# EAGLE design shinobi_5v_3V3_dcdc (EAGLE 8.2.2)
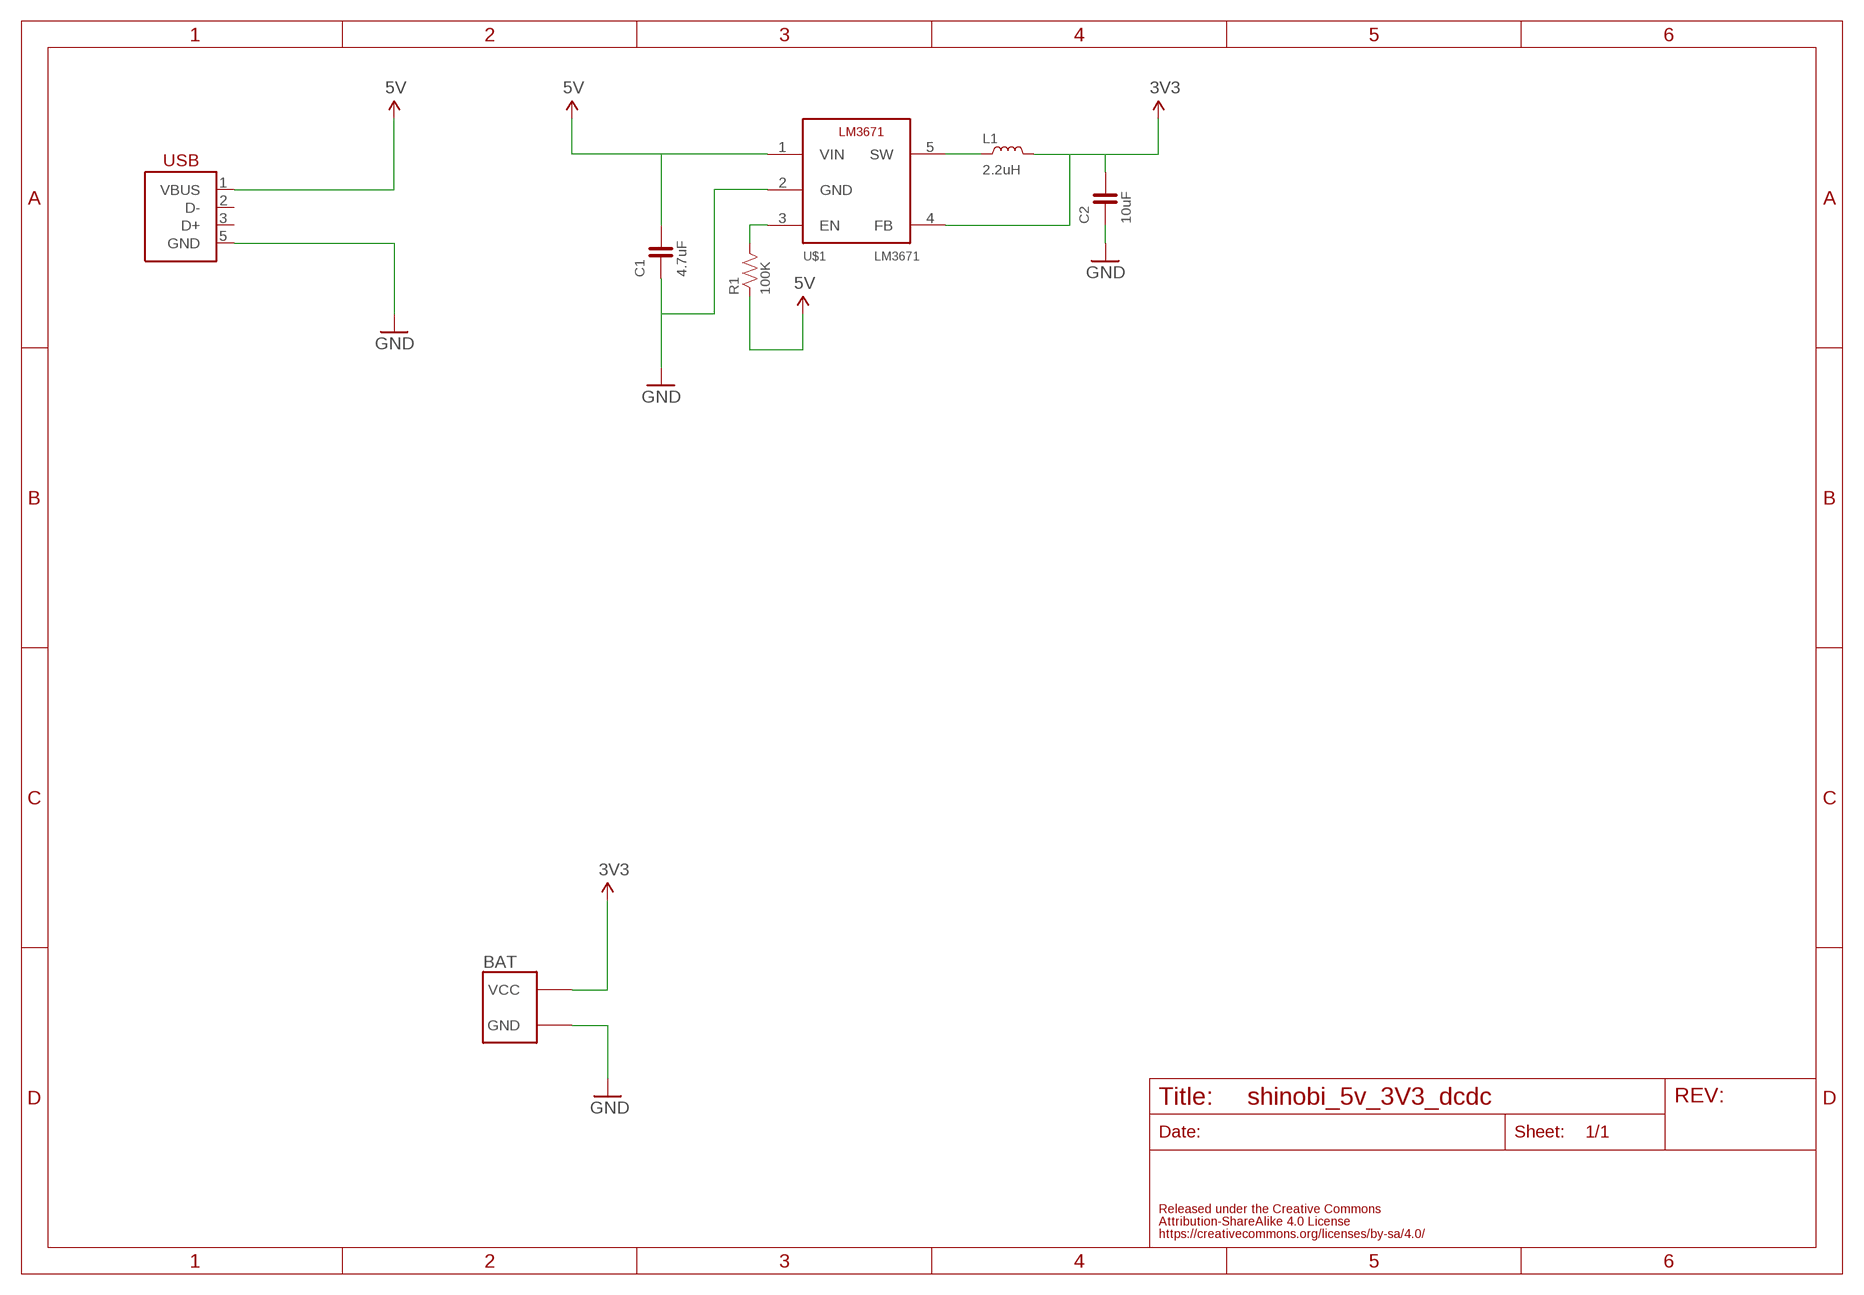
[diagram p0: schematic, sheet 1]

## Parts
BAT  FABO_BRICK_2PIN_SIDE  [FABO_BRICK_2PIN_S02B−PASK-2_SILK]
C1  4.7uF  CAPACITOR-0603  [0603]
C2  10uF  CAPACITOR-0603  [0603]
L1  2.2uH  INDUCTOR2.4X2.4  [2.4X2.4]
R1  100K  RESISTOR-0603  [0603]
U$1  LM3671  [LM3671]
USB1  USB-MICRO_B_SMT_HIROSE  [ZX62R-B-5P]

## Nets
3V3: BAT.VCC C2.2 L1.P$2 U$1.4(FB)
5V: C1.2 R1.1 U$1.1(VIN) USB1.1(VBUS)
GND: BAT.GND C1.1 C2.1 U$1.2(GND) USB1.5(GND)
N$1: R1.2 U$1.3(EN)
N$2: L1.P$1 U$1.5(SW)
Unconnected: USB1.2(D-) USB1.3(D+)

## Library data of the parts
BAT = FaBo-Template:FABO_BRICK_2PIN
C1 C2 = FaBo-Capacitor:CAPACITOR: CAPACITOR
L1 = FaBo-Coil:INDUCTOR
R1 = FaBo-Resistors:RESISTOR: RESISTOR
U$1 = FaBo-Supply:LM3671
USB1 = FaBo-USB:USB

## Board
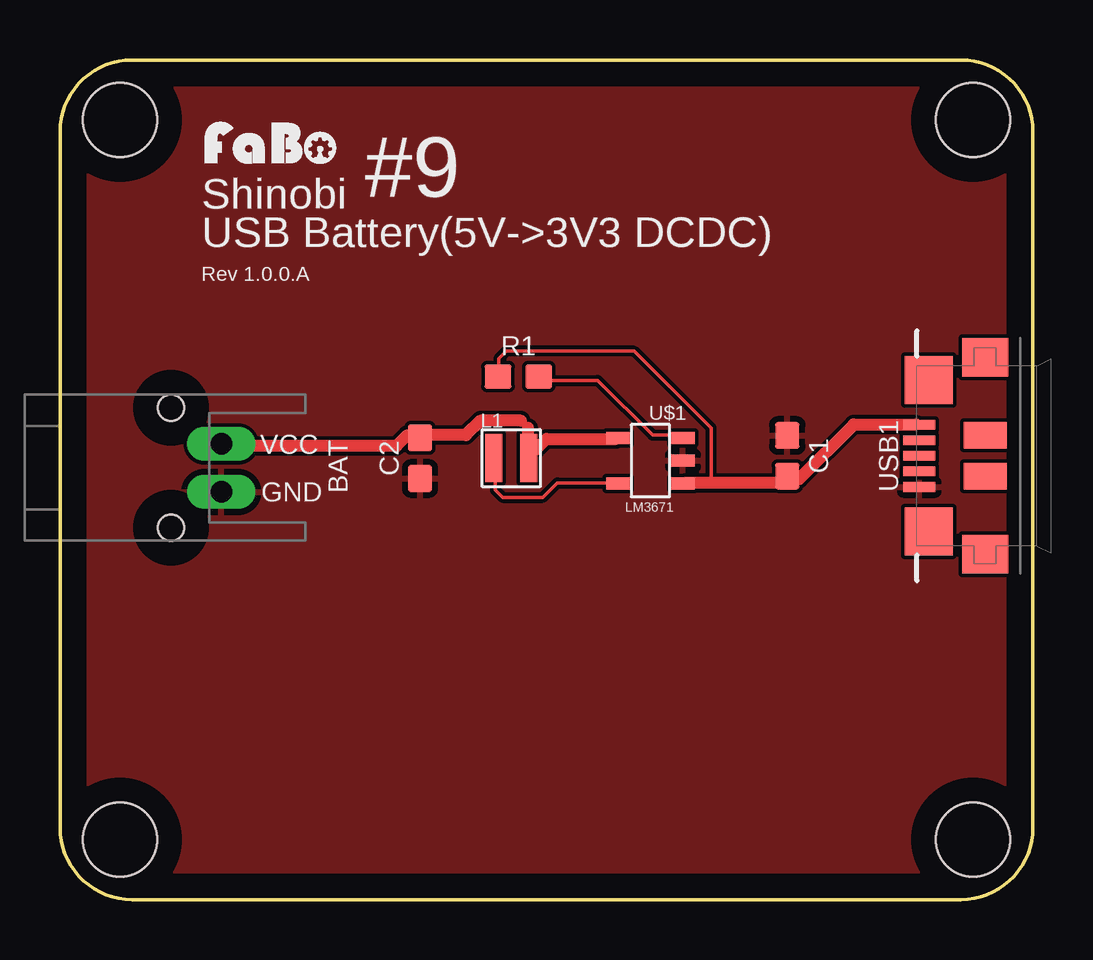
[diagram p1: board, top side]
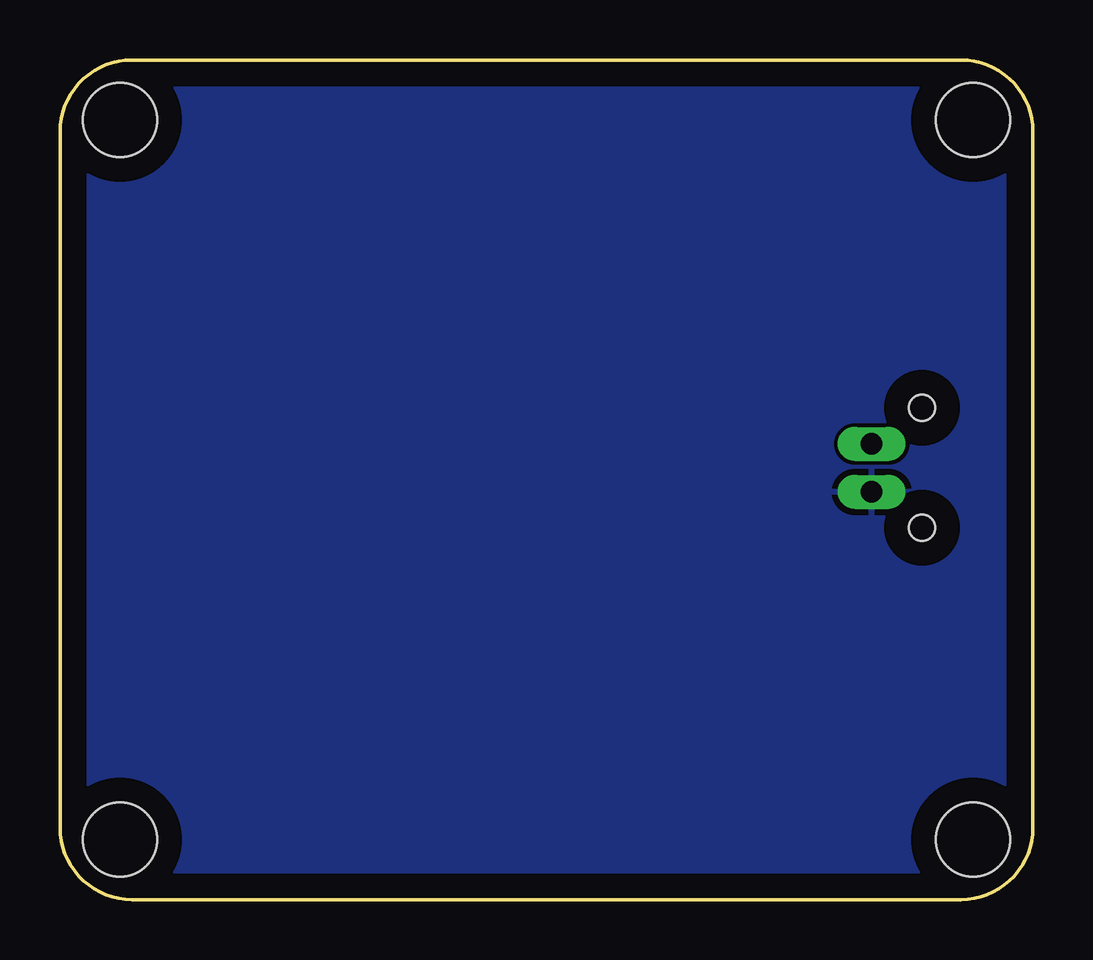
[diagram p2: board, bottom side, seen from below]

Size 40.54 x 35 mm. Coordinates in mm from the lower left corner, seen from the top.
Copper layers (1*16): Top 0.035mm / dielectric 1.5mm / Bottom 0.035mm
Design rules "default": minimum track width 6mil, minimum drill 0.35mm, track to track 6mil, track to pad 6mil, pad to pad 6mil, via to via 6mil, smd to smd 6mil, copper to edge 40mil, drill to drill 6mil, minimum pad ring 10mil, minimum via ring 8mil, stop-mask expansion 4mil, vias tented up to drill 0mil, thermal gap 10mil

### Footprints (pad centres in the part's own frame; a part is rotated, then mirrored left to right if it is on the bottom)
FABO_BRICK_2PIN_S02B−PASK-2_SILK = drill 0.9 pad 1.422 long: GND -1,-0.102; VCC 1,-0.102 | hole 1.1: 2.5,1.998; -2.5,1.998
0603 = smd 1.1 x 1: 1 -0.85,0; 2 0.85,0
2.4X2.4 = smd 0.7 x 2: P$1 -0.725,0; P$2 0.725,0
LM3671 = smd 1 x 0.5: 1 -1.35,0.95; 2 -1.35,0; 3 -1.35,-0.95; 4 1.35,-0.95; 5 1.35,0.95
FABO-SHINOBI = hole 3.1: 2.5,32.5; 38.04,32.5; 38.04,2.5; 2.5,2.5
ZX62R-B-5P = smd 0.4 x 1.35: 1 1.3,4.2; 2 0.65,4.2; 3 0,4.2; 4 -0.65,4.2; 5 -1.3,4.2 | smd 2 x 2: 6 3.15,3.8; 7 -3.15,3.8 | smd 1.6 x 1.9: 8 4.1,1.45; 11 -4.1,1.45 | smd 1.1 x 1.8: 9 0.85,1.45; 10 -0.85,1.45

### Placement (x,y rotation side)
BAT  6.62,18 90 top
C1  30.3,18.5 270 top
C2  15,18.4 90 top
L1  18.8,18.4 0 top
R1  19.1,21.8 0 top
U$1  24.6,18.3 180 top
U$2  [LOGO_FABO_S]  8.83,30.52 0 top
U$3  [FABO-SHINOBI]  0,0 0 top
USB1  40,18.5 90 top

### Tracks (layer width: path | path; a pad name or v marks a point on that pad's centre or on a via)
3V3
  Top 0.152: 19.81,18.75 19.51,18.44 L1.P$2 19.81,18.75 | 23.16,19.2 U$1.4 | 19.51,19.66 19.2,19.96 | 19.81,18.75 19.51,19.05 | 15.09,19.36 C2.2 14.94,19.36 14.48,19.36 | 6.86,18.9 BAT.VCC
  Top 0.508: 23.16,19.2 20.27,19.2 19.81,18.75 | 15.09,19.36 16.92,19.36 17.53,19.96 19.2,19.96 | 19.51,19.05 19.51,19.66 | 6.86,18.9 14.02,18.9 14.48,19.36
5V
  Top 0.152: 30.02,17.37 30.18,17.53 C1.2 30.33,17.53 30.79,17.53 | 26.06,17.37 U$1.1 | 35.66,19.81 USB1.1 | 27.13,17.37 27.13,19.66 23.93,22.86 18.59,22.86 18.29,22.55 18.29,21.95 R1.1
  Top 0.508: 30.02,17.37 27.13,17.37 26.06,17.37 | 35.66,19.81 33.07,19.81 30.79,17.53
GND
  pour Bottom: 0,0 41,0 41,35 0,35
  pour Top: 0,0 41,0 41,35 0,35
N$1
  Top 0.152: U$1.3 25.91,19.36 24.69,19.36 22.4,21.64 20.12,21.64 19.96,21.79 R1.2
N$2
  Top 0.152: U$1.5 23.16,17.37 20.73,17.37 20.12,16.76 18.44,16.76 18.14,17.07 18.14,18.29 L1.P$1

### Text on the board
tPlace: Shinobi | #9 | USB Battery(5V->3V3 DCDC) | Rev 1.0.0.A